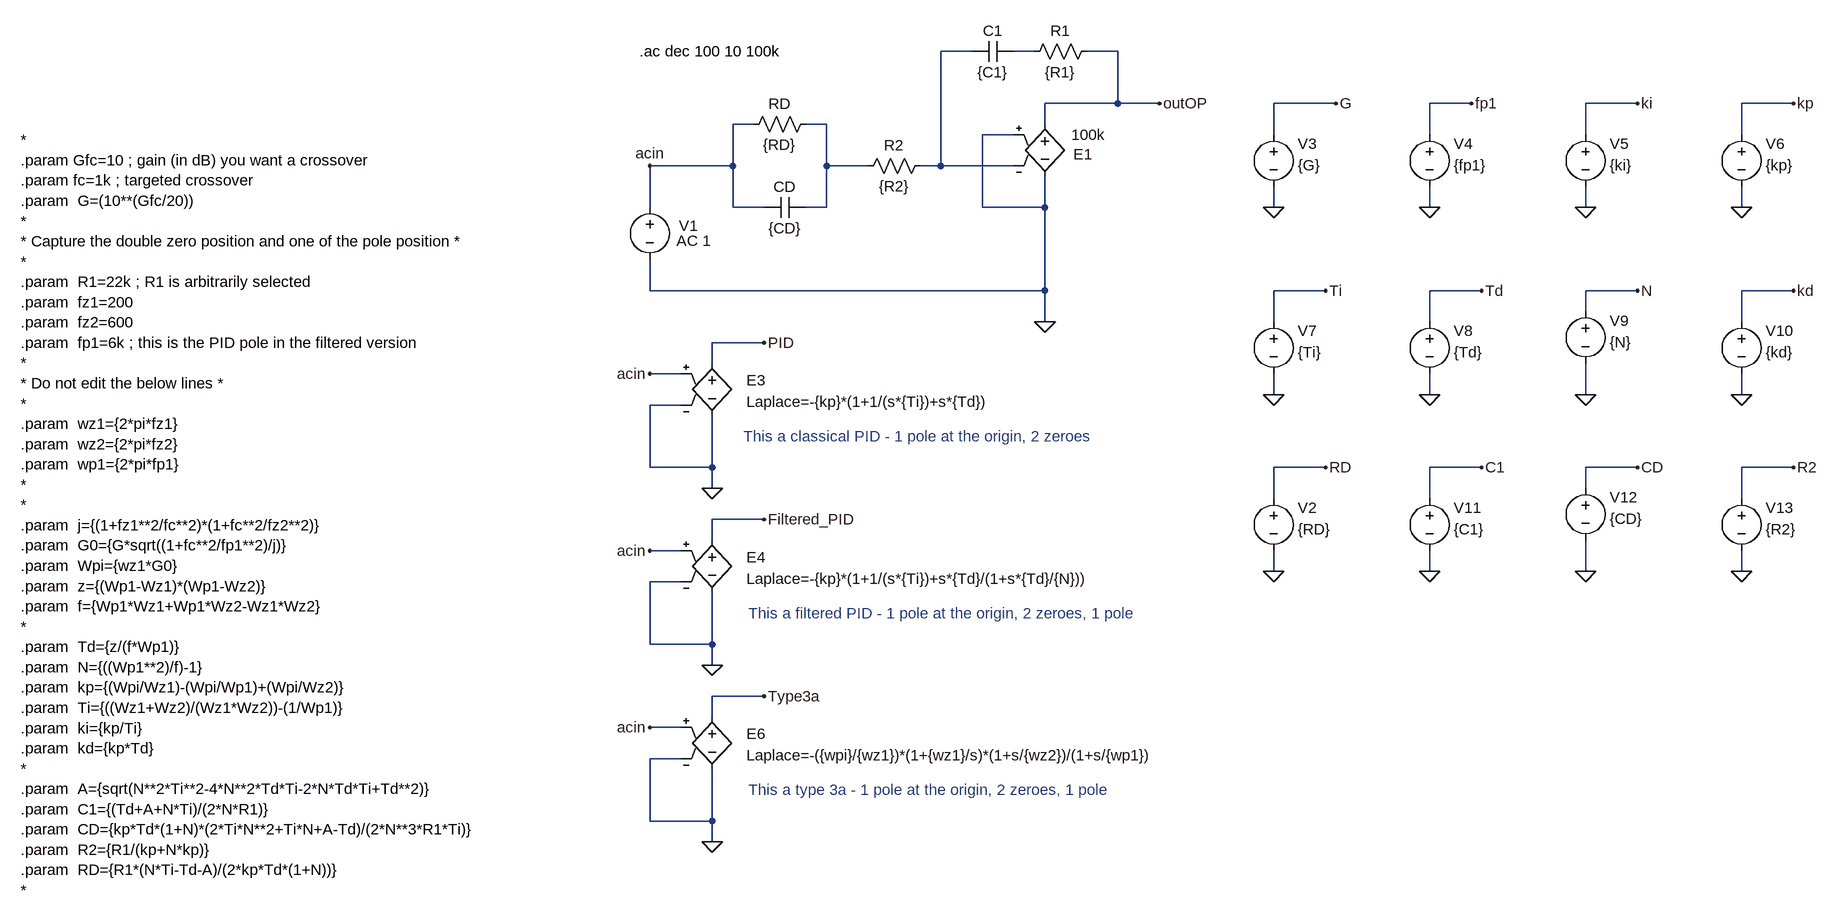
[diagram p0: schematic Simple filtered PID - E sources.asc]
Simple filtered PID - E sources.asc, the LTspice schematic file:
Version 4
SHEET 1 2344 2244
WIRE 448 32 400 32
WIRE 544 32 512 32
WIRE 672 32 624 32
WIRE 672 112 672 32
WIRE 672 112 560 112
WIRE 736 112 672 112
WIRE 1008 112 912 112
WIRE 1216 112 1152 112
WIRE 1472 112 1392 112
WIRE 1712 112 1632 112
WIRE 112 144 80 144
WIRE 224 144 192 144
WIRE 560 144 560 112
WIRE 512 160 464 160
WIRE 912 160 912 112
WIRE 1152 160 1152 112
WIRE 1392 160 1392 112
WIRE 1632 160 1632 112
WIRE 80 208 80 144
WIRE 80 208 -48 208
WIRE 224 208 224 144
WIRE 288 208 224 208
WIRE 400 208 400 32
WIRE 400 208 368 208
WIRE 512 208 400 208
WIRE -48 272 -48 208
WIRE 80 272 80 208
WIRE 128 272 80 272
WIRE 224 272 224 208
WIRE 224 272 192 272
WIRE 464 272 464 160
WIRE 560 272 560 224
WIRE 560 272 464 272
WIRE 912 272 912 240
WIRE 1152 272 1152 240
WIRE 1392 272 1392 240
WIRE 1632 272 1632 240
WIRE -48 400 -48 352
WIRE 560 400 560 272
WIRE 560 400 -48 400
WIRE 992 400 912 400
WIRE 1232 400 1152 400
WIRE 1472 400 1392 400
WIRE 1712 400 1632 400
WIRE 1392 432 1392 400
WIRE 560 448 560 400
WIRE 912 448 912 400
WIRE 1152 448 1152 400
WIRE 1632 448 1632 400
WIRE 128 480 48 480
WIRE 48 512 48 480
WIRE 0 528 -48 528
WIRE 912 560 912 528
WIRE 1152 560 1152 528
WIRE 1392 560 1392 512
WIRE 1632 560 1632 528
WIRE 0 576 -48 576
WIRE -48 672 -48 576
WIRE 48 672 48 592
WIRE 48 672 -48 672
WIRE 992 672 912 672
WIRE 1232 672 1152 672
WIRE 1472 672 1392 672
WIRE 1712 672 1632 672
WIRE 48 704 48 672
WIRE 1392 704 1392 672
WIRE 912 720 912 672
WIRE 1152 720 1152 672
WIRE 1632 720 1632 672
WIRE 128 752 48 752
WIRE 48 784 48 752
WIRE 0 800 -48 800
WIRE 912 832 912 800
WIRE 1152 832 1152 800
WIRE 1392 832 1392 784
WIRE 1632 832 1632 800
WIRE 0 848 -48 848
WIRE -48 944 -48 848
WIRE 48 944 48 864
WIRE 48 944 -48 944
WIRE 48 976 48 944
WIRE 128 1024 48 1024
WIRE 48 1056 48 1024
WIRE 0 1072 -48 1072
WIRE 0 1120 -48 1120
WIRE -48 1216 -48 1120
WIRE 48 1216 48 1136
WIRE 48 1216 -48 1216
WIRE 48 1248 48 1216
FLAG 1008 112 G
FLAG 912 272 0
FLAG 1216 112 fp1
FLAG 1152 272 0
FLAG 1472 112 ki
FLAG 1392 272 0
FLAG 1712 112 kp
FLAG 1632 272 0
FLAG 992 400 Ti
FLAG 912 560 0
FLAG 1232 400 Td
FLAG 1152 560 0
FLAG 1472 400 N
FLAG 1392 560 0
FLAG 1712 400 kd
FLAG 1632 560 0
FLAG 48 704 0
FLAG 128 480 PID
FLAG -48 528 acin
FLAG 48 976 0
FLAG 128 752 Filtered_PID
FLAG -48 800 acin
FLAG 48 1248 0
FLAG 128 1024 Type3a
FLAG -48 1072 acin
FLAG 736 112 outOP
FLAG 560 448 0
FLAG 992 672 RD
FLAG 912 832 0
FLAG 1232 672 C1
FLAG 1152 832 0
FLAG 1472 672 CD
FLAG 1392 832 0
FLAG 1712 672 R2
FLAG 1632 832 0
FLAG -48 208 acin
DATAFLAG 912 112 ""
DATAFLAG 1152 112 ""
DATAFLAG 1392 112 ""
DATAFLAG 1632 112 ""
DATAFLAG 944 400 ""
DATAFLAG 1152 400 ""
DATAFLAG 1424 400 ""
DATAFLAG 1632 400 ""
DATAFLAG 944 672 ""
DATAFLAG 1152 672 ""
DATAFLAG 1424 672 ""
DATAFLAG 1632 672 ""
SYMBOL voltage 912 144 R0
WINDOW 0 37 30 Left 2
WINDOW 3 37 63 Left 2
SYMATTR InstName V3
SYMATTR Value {G}
SYMBOL voltage 1152 144 R0
WINDOW 0 37 30 Left 2
WINDOW 3 37 63 Left 2
SYMATTR InstName V4
SYMATTR Value {fp1}
SYMBOL voltage 1392 144 R0
WINDOW 0 37 30 Left 2
WINDOW 3 37 63 Left 2
SYMATTR InstName V5
SYMATTR Value {ki}
SYMBOL voltage 1632 144 R0
WINDOW 0 37 30 Left 2
WINDOW 3 37 63 Left 2
SYMATTR InstName V6
SYMATTR Value {kp}
SYMBOL voltage 912 432 R0
WINDOW 0 37 30 Left 2
WINDOW 3 37 63 Left 2
SYMATTR InstName V7
SYMATTR Value {Ti}
SYMBOL voltage 1152 432 R0
WINDOW 0 37 30 Left 2
WINDOW 3 37 63 Left 2
SYMATTR InstName V8
SYMATTR Value {Td}
SYMBOL voltage 1392 416 R0
WINDOW 0 37 30 Left 2
WINDOW 3 37 63 Left 2
SYMATTR InstName V9
SYMATTR Value {N}
SYMBOL voltage 1632 432 R0
WINDOW 0 37 30 Left 2
WINDOW 3 37 63 Left 2
SYMATTR InstName V10
SYMATTR Value {kd}
SYMBOL e 48 496 R0
WINDOW 0 53 42 Left 2
WINDOW 3 53 75 Left 2
SYMATTR InstName E3
SYMATTR Value Laplace=-{kp}*(1+1/(s*{Ti})+s*{Td})
SYMBOL e 48 768 R0
WINDOW 0 53 42 Left 2
WINDOW 3 53 75 Left 2
SYMATTR InstName E4
SYMATTR Value Laplace=-{kp}*(1+1/(s*{Ti})+s*{Td}/(1+s*{Td}/{N}))
SYMBOL e 48 1040 R0
WINDOW 0 53 42 Left 2
WINDOW 3 53 75 Left 2
SYMATTR InstName E6
SYMATTR Value Laplace=-({wpi}/{wz1})*(1+{wz1}/s)*(1+s/{wz2})/(1+s/{wp1})
SYMBOL e 560 128 R0
WINDOW 0 44 62 Left 2
WINDOW 3 41 32 Left 2
SYMATTR InstName E1
SYMATTR Value 100k
SYMBOL res 640 16 R90
WINDOW 0 0 56 VBottom 2
WINDOW 3 32 56 VTop 2
SYMATTR InstName R1
SYMATTR Value {R1}
SYMBOL cap 512 16 R90
WINDOW 0 0 32 VBottom 2
WINDOW 3 32 32 VTop 2
SYMATTR InstName C1
SYMATTR Value {C1}
SYMBOL res 384 192 R90
WINDOW 0 0 56 VBottom 2
WINDOW 3 32 56 VTop 2
SYMATTR InstName R2
SYMATTR Value {R2}
SYMBOL res 208 128 R90
WINDOW 0 0 56 VBottom 2
WINDOW 3 32 56 VTop 2
SYMATTR InstName RD
SYMATTR Value {RD}
SYMBOL cap 192 256 R90
WINDOW 0 0 32 VBottom 2
WINDOW 3 32 32 VTop 2
SYMATTR InstName CD
SYMATTR Value {CD}
SYMBOL voltage -48 256 R0
WINDOW 0 45 44 Left 2
WINDOW 123 41 67 Left 2
WINDOW 39 0 0 Left 0
SYMATTR InstName V1
SYMATTR Value ""
SYMATTR Value2 AC 1
SYMBOL voltage 912 704 R0
WINDOW 0 37 30 Left 2
WINDOW 3 37 63 Left 2
SYMATTR InstName V2
SYMATTR Value {RD}
SYMBOL voltage 1152 704 R0
WINDOW 0 37 30 Left 2
WINDOW 3 37 63 Left 2
SYMATTR InstName V11
SYMATTR Value {C1}
SYMBOL voltage 1392 688 R0
WINDOW 0 37 30 Left 2
WINDOW 3 37 63 Left 2
SYMATTR InstName V12
SYMATTR Value {CD}
SYMBOL voltage 1632 704 R0
WINDOW 0 37 30 Left 2
WINDOW 3 37 63 Left 2
SYMATTR InstName V13
SYMATTR Value {R2}
TEXT -1016 168 Left 2 !*\n.param Gfc=10 ; gain (in dB) you want a crossover\n.param fc=1k ; targeted crossover\n.param  G=(10**(Gfc/20))\n*\n* Capture the double zero position and one of the pole position *\n*\n.param  R1=22k ; R1 is arbitrarily selected\n.param  fz1=200\n.param  fz2=600\n.param  fp1=6k ; this is the PID pole in the filtered version\n*\n* Do not edit the below lines *\n*\n.param  wz1={2*pi*fz1}\n.param  wz2={2*pi*fz2}\n.param  wp1={2*pi*fp1}\n*\n*\n.param  j={(1+fz1**2/fc**2)*(1+fc**2/fz2**2)}\n.param  G0={G*sqrt((1+fc**2/fp1**2)/j)}\n.param  Wpi={wz1*G0}\n.param  z={(Wp1-Wz1)*(Wp1-Wz2)}\n.param  f={Wp1*Wz1+Wp1*Wz2-Wz1*Wz2}\n*\n.param  Td={z/(f*Wp1)}\n.param  N={((Wp1**2)/f)-1}\n.param  kp={(Wpi/Wz1)-(Wpi/Wp1)+(Wpi/Wz2)}\n.param  Ti={((Wz1+Wz2)/(Wz1*Wz2))-(1/Wp1)}\n.param  ki={kp/Ti}\n.param  kd={kp*Td}\n*\n.param  A={sqrt(N**2*Ti**2-4*N**2*Td*Ti-2*N*Td*Ti+Td**2)}\n.param  C1={(Td+A+N*Ti)/(2*N*R1)}\n.param  CD={kp*Td*(1+N)*(2*Ti*N**2+Ti*N+A-Td)/(2*N**3*R1*Ti)}\n.param  R2={R1/(kp+N*kp)}\n.param  RD={R1*(N*Ti-Td-A)/(2*kp*Td*(1+N))}\n*
TEXT -64 32 Left 2 !.ac dec 100 10 100k
TEXT 96 624 Left 2 ;This a classical PID - 1 pole at the origin, 2 zeroes
TEXT 104 896 Left 2 ;This a filtered PID - 1 pole at the origin, 2 zeroes, 1 pole
TEXT 104 1168 Left 2 ;This a type 3a - 1 pole at the origin, 2 zeroes, 1 pole

The netlist it stands for:
* Simple filtered PID - E sources.asc
V3 G 0 {G}
V4 fp1 0 {fp1}
V5 ki 0 {ki}
V6 kp 0 {kp}
V7 Ti 0 {Ti}
V8 Td 0 {Td}
V9 N 0 {N}
V10 kd 0 {kd}
E3 PID 0 acin 0 Laplace=-{kp}*(1+1/(s*{Ti})+s*{Td})
E4 Filtered_PID 0 acin 0 Laplace=-{kp}*(1+1/(s*{Ti})+s*{Td}/(1+s*{Td}/{N}))
E6 Type3a 0 acin 0 Laplace=-({wpi}/{wz1})*(1+{wz1}/s)*(1+s/{wz2})/(1+s/{wp1})
E1 outOP 0 0 N001 100k
R1 outOP N002 {R1}
C1 N002 N001 {C1}
R2 N001 N003 {R2}
RD N003 acin {RD}
CD N003 acin {CD}
V1 acin 0 AC 1
V2 RD 0 {RD}
V11 C1 0 {C1}
V12 CD 0 {CD}
V13 R2 0 {R2}
*
.param Gfc=10 ; gain (in dB) you want a crossover
.param fc=1k ; targeted crossover
.param  G=(10**(Gfc/20))
*
* Capture the double zero position and one of the pole position *
*
.param  R1=22k ; R1 is arbitrarily selected
.param  fz1=200
.param  fz2=600
.param  fp1=6k ; this is the PID pole in the filtered version
*
* Do not edit the below lines *
*
.param  wz1={2*pi*fz1}
.param  wz2={2*pi*fz2}
.param  wp1={2*pi*fp1}
*
*
.param  j={(1+fz1**2/fc**2)*(1+fc**2/fz2**2)}
.param  G0={G*sqrt((1+fc**2/fp1**2)/j)}
.param  Wpi={wz1*G0}
.param  z={(Wp1-Wz1)*(Wp1-Wz2)}
.param  f={Wp1*Wz1+Wp1*Wz2-Wz1*Wz2}
*
.param  Td={z/(f*Wp1)}
.param  N={((Wp1**2)/f)-1}
.param  kp={(Wpi/Wz1)-(Wpi/Wp1)+(Wpi/Wz2)}
.param  Ti={((Wz1+Wz2)/(Wz1*Wz2))-(1/Wp1)}
.param  ki={kp/Ti}
.param  kd={kp*Td}
*
.param  A={sqrt(N**2*Ti**2-4*N**2*Td*Ti-2*N*Td*Ti+Td**2)}
.param  C1={(Td+A+N*Ti)/(2*N*R1)}
.param  CD={kp*Td*(1+N)*(2*Ti*N**2+Ti*N+A-Td)/(2*N**3*R1*Ti)}
.param  R2={R1/(kp+N*kp)}
.param  RD={R1*(N*Ti-Td-A)/(2*kp*Td*(1+N))}
*
.ac dec 100 10 100k
* This a classical PID - 1 pole at the origin, 2 zeroes
* This a filtered PID - 1 pole at the origin, 2 zeroes, 1 pole
* This a type 3a - 1 pole at the origin, 2 zeroes, 1 pole
.backanno
.end